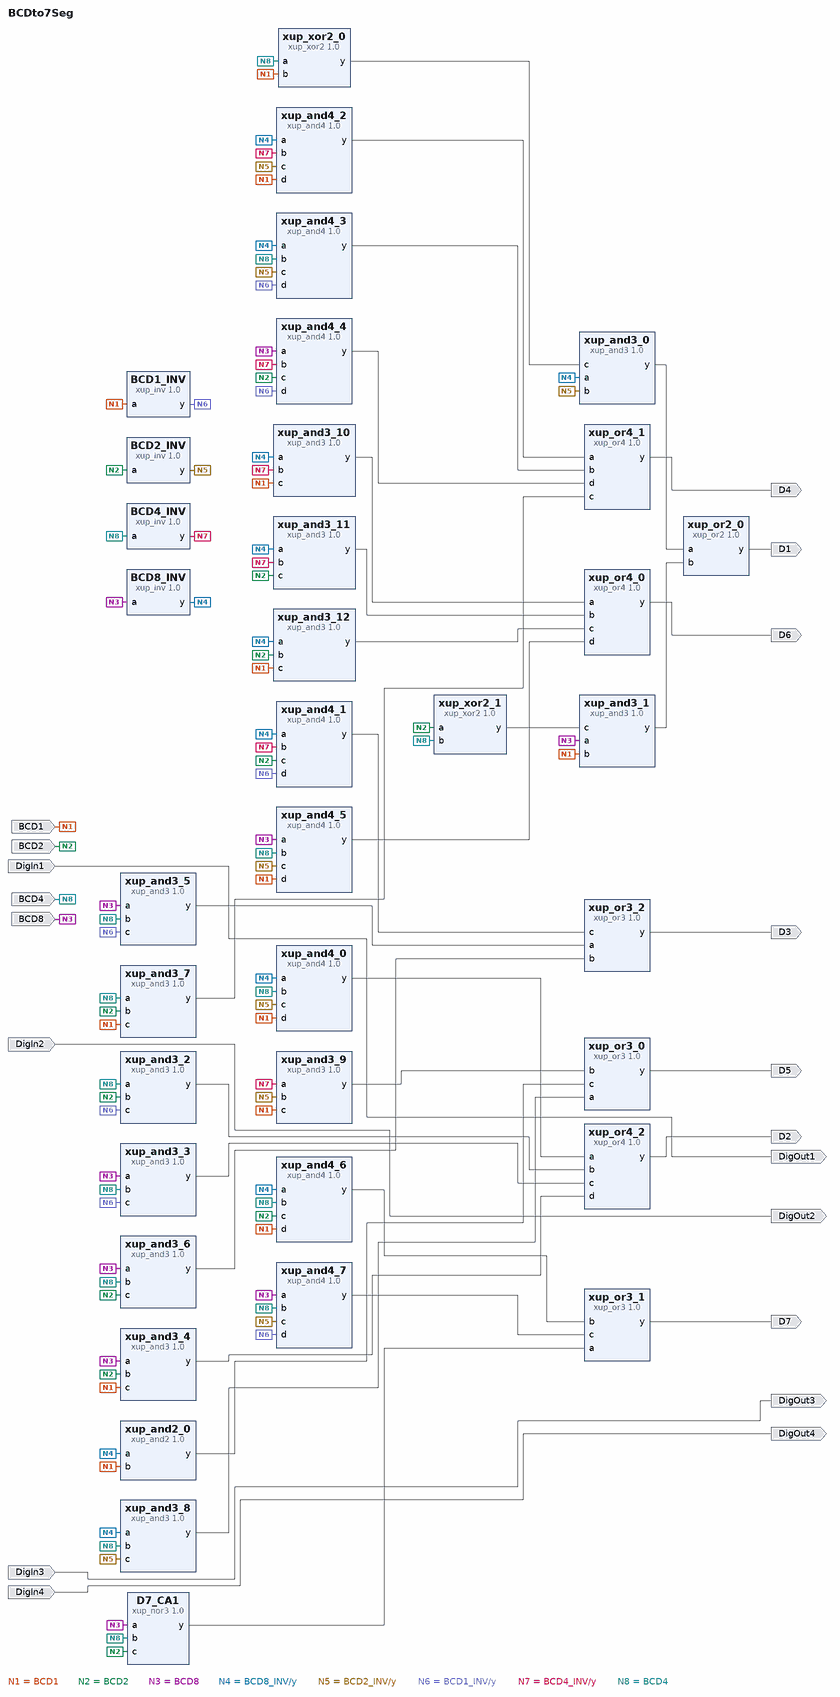
[diagram p0: block diagram of the top level]
# Vivado block design BCDto7Seg, xc7a35tcpg236-1, Vivado 2018.3
create_bd_design BCDto7Seg

create_bd_port -dir I DigIn1
create_bd_port -dir I DigIn2
create_bd_port -dir I DigIn3
create_bd_port -dir I DigIn4
create_bd_port -dir O DigOut1
create_bd_port -dir O DigOut2
create_bd_port -dir O DigOut3
create_bd_port -dir O DigOut4
create_bd_port -dir I BCD8
create_bd_port -dir I BCD4
create_bd_port -dir I BCD2
create_bd_port -dir I BCD1
create_bd_port -dir O D1
create_bd_port -dir O D2
create_bd_port -dir O D3
create_bd_port -dir O D4
create_bd_port -dir O D5
create_bd_port -dir O D6
create_bd_port -dir O D7

create_bd_cell -type ip -vlnv xilinx.com:xup:xup_inv:1.0 BCD1_INV
create_bd_cell -type ip -vlnv xilinx.com:xup:xup_inv:1.0 BCD2_INV
create_bd_cell -type ip -vlnv xilinx.com:xup:xup_inv:1.0 BCD4_INV
create_bd_cell -type ip -vlnv xilinx.com:xup:xup_inv:1.0 BCD8_INV
create_bd_cell -type ip -vlnv xilinx.com:xup:xup_and3:1.0 xup_and3_0
create_bd_cell -type ip -vlnv xilinx.com:xup:xup_xor2:1.0 xup_xor2_0
create_bd_cell -type ip -vlnv xilinx.com:xup:xup_and3:1.0 xup_and3_1
create_bd_cell -type ip -vlnv xilinx.com:xup:xup_xor2:1.0 xup_xor2_1
create_bd_cell -type ip -vlnv xilinx.com:xup:xup_and4:1.0 xup_and4_0
create_bd_cell -type ip -vlnv xilinx.com:xup:xup_and3:1.0 xup_and3_2
create_bd_cell -type ip -vlnv xilinx.com:xup:xup_and3:1.0 xup_and3_3
create_bd_cell -type ip -vlnv xilinx.com:xup:xup_and3:1.0 xup_and3_4
create_bd_cell -type ip -vlnv xilinx.com:xup:xup_and3:1.0 xup_and3_5
create_bd_cell -type ip -vlnv xilinx.com:xup:xup_and3:1.0 xup_and3_6
create_bd_cell -type ip -vlnv xilinx.com:xup:xup_and4:1.0 xup_and4_1
create_bd_cell -type ip -vlnv xilinx.com:xup:xup_and4:1.0 xup_and4_2
create_bd_cell -type ip -vlnv xilinx.com:xup:xup_and4:1.0 xup_and4_3
create_bd_cell -type ip -vlnv xilinx.com:xup:xup_and3:1.0 xup_and3_7
create_bd_cell -type ip -vlnv xilinx.com:xup:xup_and4:1.0 xup_and4_4
create_bd_cell -type ip -vlnv xilinx.com:xup:xup_and3:1.0 xup_and3_8
create_bd_cell -type ip -vlnv xilinx.com:xup:xup_and3:1.0 xup_and3_9
create_bd_cell -type ip -vlnv xilinx.com:xup:xup_and2:1.0 xup_and2_0
create_bd_cell -type ip -vlnv xilinx.com:xup:xup_and3:1.0 xup_and3_10
create_bd_cell -type ip -vlnv xilinx.com:xup:xup_and3:1.0 xup_and3_11
create_bd_cell -type ip -vlnv xilinx.com:xup:xup_and3:1.0 xup_and3_12
create_bd_cell -type ip -vlnv xilinx.com:xup:xup_and4:1.0 xup_and4_5
create_bd_cell -type ip -vlnv xilinx.com:xup:xup_nor3:1.0 D7_CA1
create_bd_cell -type ip -vlnv xilinx.com:xup:xup_and4:1.0 xup_and4_6
create_bd_cell -type ip -vlnv xilinx.com:xup:xup_and4:1.0 xup_and4_7
create_bd_cell -type ip -vlnv xilinx.com:xup:xup_or4:1.0 xup_or4_0
create_bd_cell -type ip -vlnv xilinx.com:xup:xup_or3:1.0 xup_or3_0
create_bd_cell -type ip -vlnv xilinx.com:xup:xup_or3:1.0 xup_or3_1
create_bd_cell -type ip -vlnv xilinx.com:xup:xup_or2:1.0 xup_or2_0
create_bd_cell -type ip -vlnv xilinx.com:xup:xup_or4:1.0 xup_or4_1
create_bd_cell -type ip -vlnv xilinx.com:xup:xup_or4:1.0 xup_or4_2
create_bd_cell -type ip -vlnv xilinx.com:xup:xup_or3:1.0 xup_or3_2

# ---- connections ----

connect_bd_net -net DigIn1_1 [get_bd_ports DigIn1] [get_bd_ports DigOut1]
connect_bd_net -net DigIn2_1 [get_bd_ports DigIn2] [get_bd_ports DigOut2]
connect_bd_net -net DigIn3_1 [get_bd_ports DigIn3] [get_bd_ports DigOut3]
connect_bd_net -net DigIn4_1 [get_bd_ports DigIn4] [get_bd_ports DigOut4]
connect_bd_net -net BCD1_1 [get_bd_ports BCD1] \
  [get_bd_pins BCD1_INV/a] [get_bd_pins xup_xor2_0/b] [get_bd_pins xup_and3_1/b] [get_bd_pins xup_and4_0/d] \
  [get_bd_pins xup_and3_4/c] [get_bd_pins xup_and4_2/d] [get_bd_pins xup_and3_7/c] [get_bd_pins xup_and3_9/c] \
  [get_bd_pins xup_and2_0/b] [get_bd_pins xup_and3_10/c] [get_bd_pins xup_and3_12/c] [get_bd_pins xup_and4_5/d] \
  [get_bd_pins xup_and4_6/d]
connect_bd_net -net BCD2_1 [get_bd_ports BCD2] \
  [get_bd_pins BCD2_INV/a] [get_bd_pins xup_and3_2/b] [get_bd_pins xup_and3_4/b] [get_bd_pins xup_and3_6/c] \
  [get_bd_pins xup_and4_1/c] [get_bd_pins xup_and3_7/b] [get_bd_pins xup_and4_4/c] [get_bd_pins xup_and3_11/c] \
  [get_bd_pins xup_and3_12/b] [get_bd_pins xup_xor2_1/a] [get_bd_pins D7_CA1/c] [get_bd_pins xup_and4_6/c]
connect_bd_net -net BCD8_1 [get_bd_ports BCD8] \
  [get_bd_pins BCD8_INV/a] [get_bd_pins xup_and3_1/a] [get_bd_pins xup_and3_3/a] [get_bd_pins xup_and3_4/a] \
  [get_bd_pins xup_and3_5/a] [get_bd_pins xup_and3_6/a] [get_bd_pins xup_and4_4/a] [get_bd_pins xup_and4_5/a] \
  [get_bd_pins D7_CA1/a] [get_bd_pins xup_and4_7/a]
connect_bd_net [get_bd_pins BCD8_INV/y] \
  [get_bd_pins xup_and3_0/a] [get_bd_pins xup_and4_0/a] [get_bd_pins xup_and4_1/a] [get_bd_pins xup_and4_2/a] \
  [get_bd_pins xup_and4_3/a] [get_bd_pins xup_and3_8/a] [get_bd_pins xup_and2_0/a] [get_bd_pins xup_and3_10/a] \
  [get_bd_pins xup_and3_11/a] [get_bd_pins xup_and3_12/a] [get_bd_pins xup_and4_6/a]
connect_bd_net [get_bd_pins xup_xor2_0/y] [get_bd_pins xup_and3_0/c]
connect_bd_net [get_bd_pins BCD2_INV/y] \
  [get_bd_pins xup_and3_0/b] [get_bd_pins xup_and4_0/c] [get_bd_pins xup_and4_2/c] [get_bd_pins xup_and4_3/c] \
  [get_bd_pins xup_and3_8/c] [get_bd_pins xup_and3_9/b] [get_bd_pins xup_and4_5/c] [get_bd_pins xup_and4_7/c]
connect_bd_net [get_bd_pins xup_and3_0/y] [get_bd_pins xup_or2_0/a]
connect_bd_net [get_bd_pins xup_and3_1/y] [get_bd_pins xup_or2_0/b]
connect_bd_net [get_bd_pins xup_xor2_1/y] [get_bd_pins xup_and3_1/c]
connect_bd_net [get_bd_pins xup_and4_0/y] [get_bd_pins xup_or4_2/a]
connect_bd_net [get_bd_pins xup_and3_2/y] [get_bd_pins xup_or4_2/b]
connect_bd_net [get_bd_pins BCD1_INV/y] \
  [get_bd_pins xup_and3_2/c] [get_bd_pins xup_and3_3/c] [get_bd_pins xup_and3_5/c] [get_bd_pins xup_and4_1/d] \
  [get_bd_pins xup_and4_3/d] [get_bd_pins xup_and4_4/d] [get_bd_pins xup_and4_7/d]
connect_bd_net [get_bd_pins xup_and3_3/y] [get_bd_pins xup_or4_2/c]
connect_bd_net [get_bd_pins xup_and3_4/y] [get_bd_pins xup_or4_2/d]
connect_bd_net [get_bd_pins xup_and3_5/y] [get_bd_pins xup_or3_2/a]
connect_bd_net [get_bd_pins xup_and3_6/y] [get_bd_pins xup_or3_2/b]
connect_bd_net [get_bd_pins xup_and4_1/y] [get_bd_pins xup_or3_2/c]
connect_bd_net [get_bd_pins BCD4_INV/y] \
  [get_bd_pins xup_and4_1/b] [get_bd_pins xup_and4_2/b] [get_bd_pins xup_and4_4/b] [get_bd_pins xup_and3_9/a] \
  [get_bd_pins xup_and3_10/b] [get_bd_pins xup_and3_11/b]
connect_bd_net [get_bd_pins xup_and4_2/y] [get_bd_pins xup_or4_1/a]
connect_bd_net [get_bd_pins xup_and4_3/y] [get_bd_pins xup_or4_1/b]
connect_bd_net [get_bd_pins xup_and3_7/y] [get_bd_pins xup_or4_1/c]
connect_bd_net [get_bd_pins xup_and4_4/y] [get_bd_pins xup_or4_1/d]
connect_bd_net [get_bd_pins xup_and3_8/y] [get_bd_pins xup_or3_0/a]
connect_bd_net [get_bd_pins xup_and3_9/y] [get_bd_pins xup_or3_0/b]
connect_bd_net [get_bd_pins xup_and2_0/y] [get_bd_pins xup_or3_0/c]
connect_bd_net [get_bd_pins xup_and3_10/y] [get_bd_pins xup_or4_0/a]
connect_bd_net [get_bd_pins xup_and3_11/y] [get_bd_pins xup_or4_0/b]
connect_bd_net [get_bd_pins xup_and3_12/y] [get_bd_pins xup_or4_0/c]
connect_bd_net [get_bd_pins xup_and4_5/y] [get_bd_pins xup_or4_0/d]
connect_bd_net -net BCD4_1 [get_bd_ports BCD4] \
  [get_bd_pins xup_and4_5/b] [get_bd_pins BCD4_INV/a] [get_bd_pins xup_and4_0/b] [get_bd_pins xup_and3_2/a] \
  [get_bd_pins xup_and3_3/b] [get_bd_pins xup_and3_5/b] [get_bd_pins xup_and3_6/b] [get_bd_pins xup_and4_3/b] \
  [get_bd_pins xup_and3_7/a] [get_bd_pins xup_and3_8/b] [get_bd_pins D7_CA1/b] [get_bd_pins xup_and4_6/b] \
  [get_bd_pins xup_and4_7/b] [get_bd_pins xup_xor2_0/a] [get_bd_pins xup_xor2_1/b]
connect_bd_net [get_bd_pins D7_CA1/y] [get_bd_pins xup_or3_1/a]
connect_bd_net [get_bd_pins xup_and4_6/y] [get_bd_pins xup_or3_1/b]
connect_bd_net [get_bd_pins xup_and4_7/y] [get_bd_pins xup_or3_1/c]
connect_bd_net [get_bd_pins xup_or4_0/y] [get_bd_ports D6]
connect_bd_net [get_bd_pins xup_or3_0/y] [get_bd_ports D5]
connect_bd_net [get_bd_pins xup_or3_1/y] [get_bd_ports D7]
connect_bd_net [get_bd_pins xup_or2_0/y] [get_bd_ports D1]
connect_bd_net [get_bd_pins xup_or4_1/y] [get_bd_ports D4]
connect_bd_net [get_bd_pins xup_or4_2/y] [get_bd_ports D2]
connect_bd_net [get_bd_pins xup_or3_2/y] [get_bd_ports D3]

validate_bd_design
save_bd_design
